# Altium schematic sheet Jukebox Schematic.SchDoc
size C
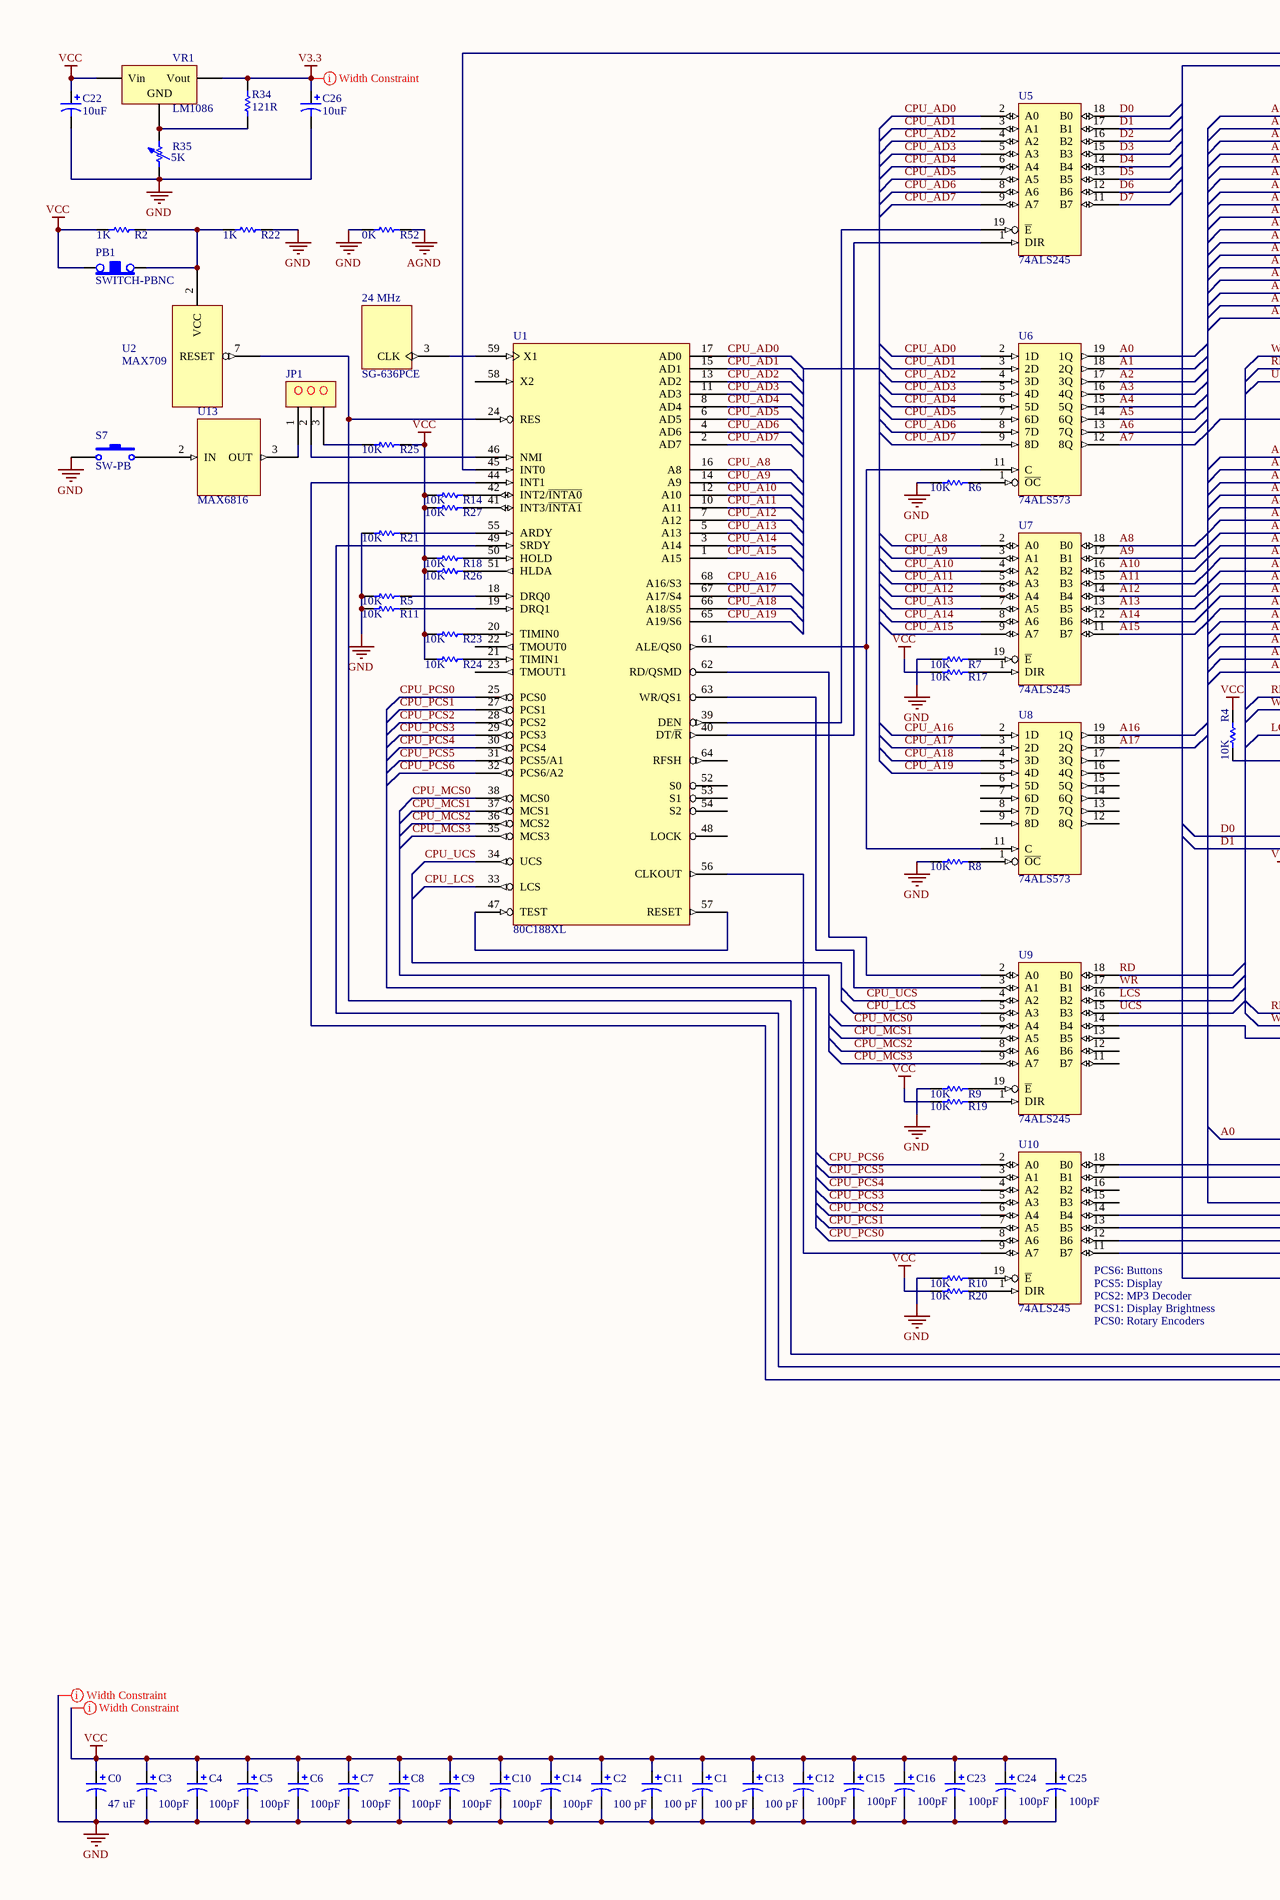
[diagram p0: Jukebox Schematic.SchDoc, left]
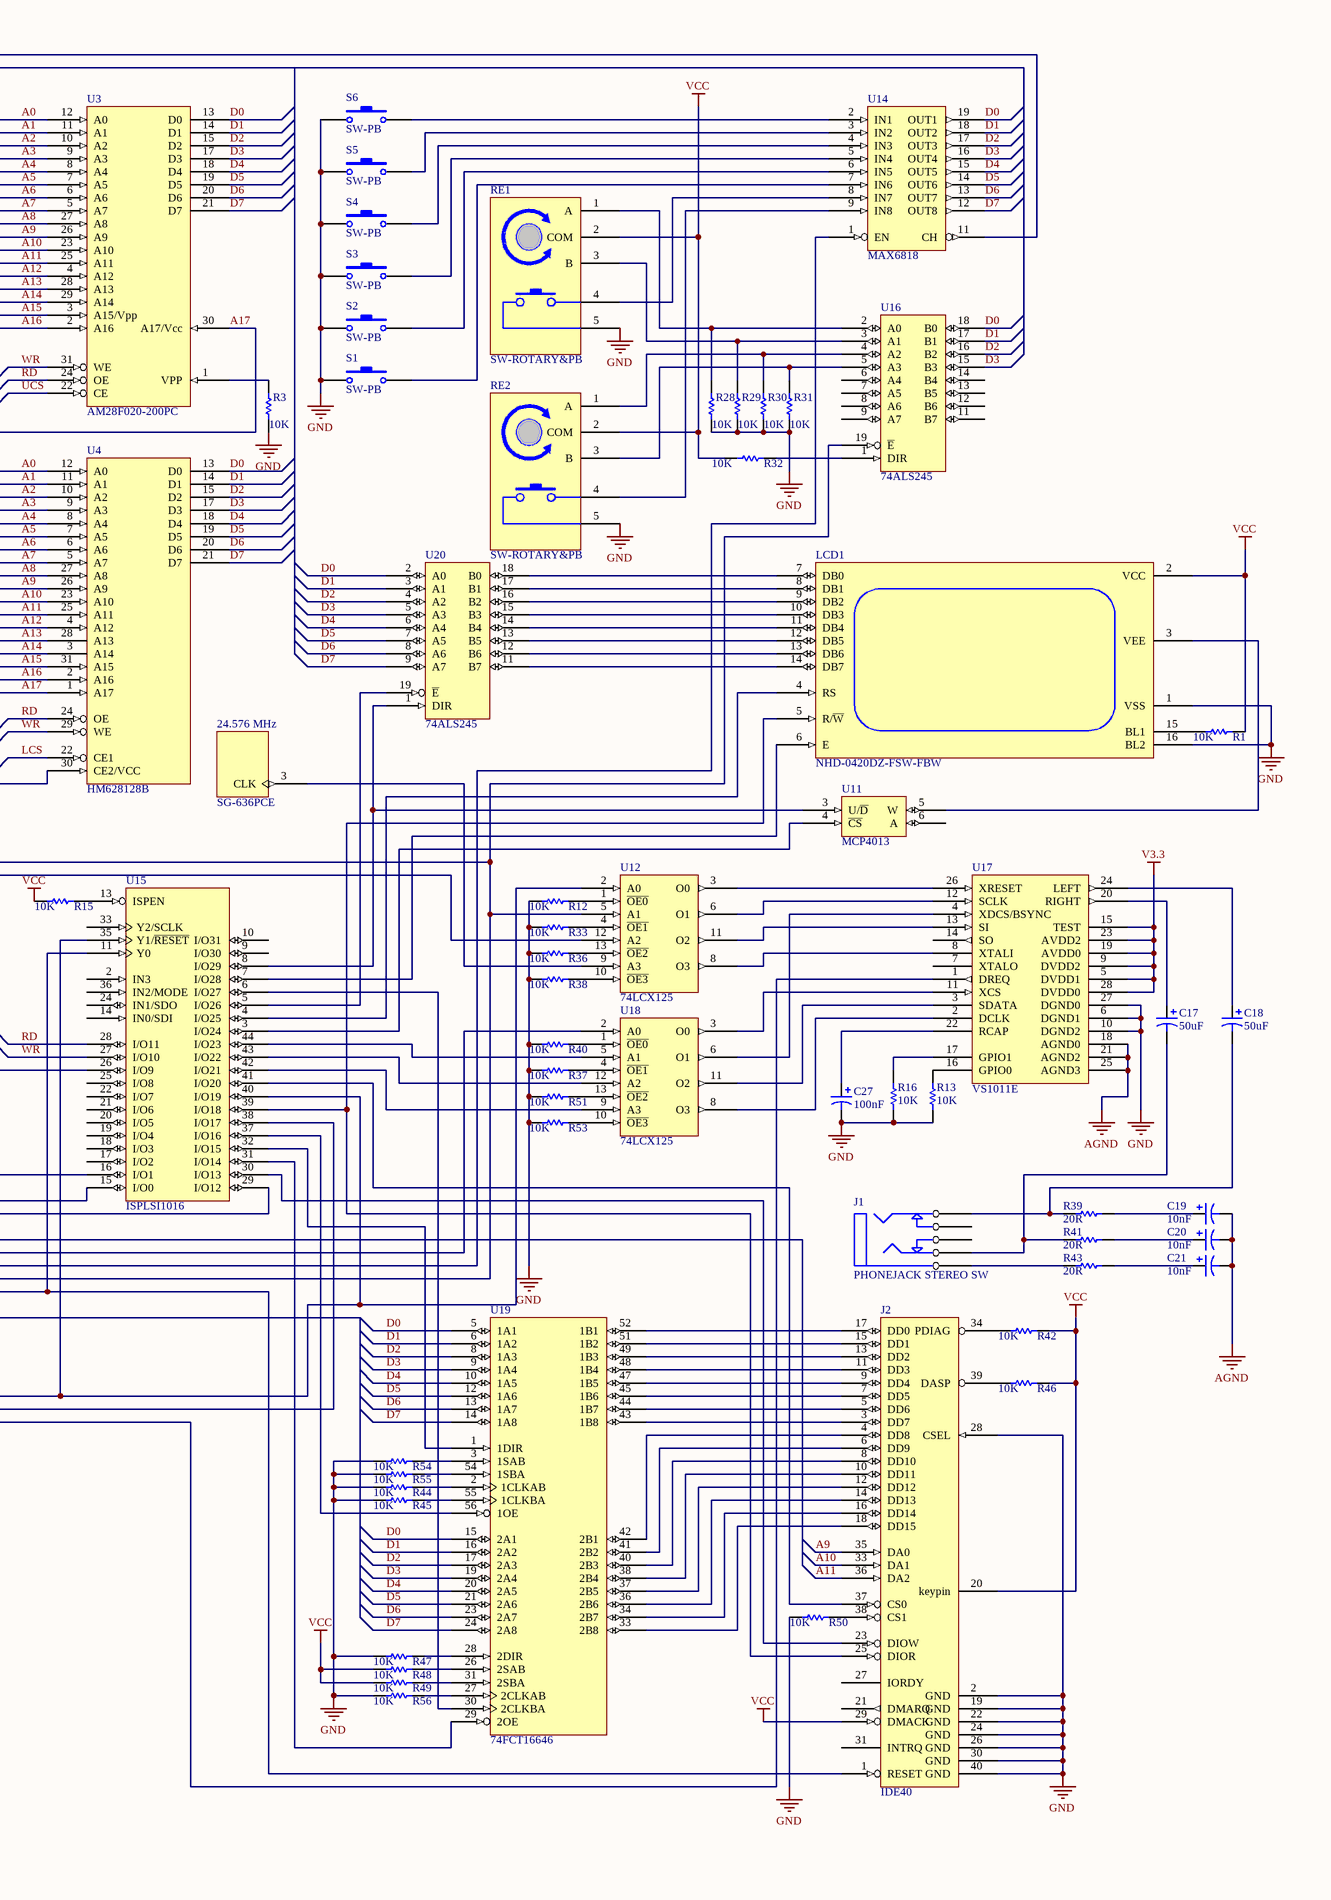
[diagram p1: Jukebox Schematic.SchDoc, right]

## Parts
24.576_MHz  SG-636PCE  [SG636PCE]
24_MHz  SG-636PCE  [SG636PCE]
C0  value 47 uF  [C0805]  (hidden comment: Cap Pol3)
C1  value 100 pF  [C0805]  (hidden comment: Cap Pol3)
C2  value 100 pF  [C0805]  (hidden comment: Cap Pol3)
C3  value 100pF  [C0805]  (hidden comment: Cap Pol3)
C4  value 100pF  [C0805]  (hidden comment: Cap Pol3)
C5  value 100pF  [C0805]  (hidden comment: Cap Pol3)
C6  value 100pF  [C0805]  (hidden comment: Cap Pol3)
C7  value 100pF  [C0805]  (hidden comment: Cap Pol3)
C8  value 100pF  [C0805]  (hidden comment: Cap Pol3)
C9  value 100pF  [C0805]  (hidden comment: Cap Pol3)
C10  value 100pF  [C0805]  (hidden comment: Cap Pol3)
C11  value 100 pF  [C0805]  (hidden comment: Cap Pol3)
C12  value 100pF  [C0805]  (hidden comment: Cap Pol3)
C13  value 100 pF  [C0805]  (hidden comment: Cap Pol3)
C14  value 100pF  [C0805]  (hidden comment: Cap Pol3)
C15  value 100pF  [C0805]  (hidden comment: Cap Pol3)
C16  value 100pF  [C0805]  (hidden comment: Cap Pol3)
C17  value 50uF  [C0805]  (hidden comment: Cap Pol3)
C18  value 50uF  [C0805]  (hidden comment: Cap Pol3)
C19  value 10nF  [C0805]  (hidden comment: Cap Pol3)
C20  value 10nF  [C0805]  (hidden comment: Cap Pol3)
C21  value 10nF  [C0805]  (hidden comment: Cap Pol3)
C22  value 10uF  [C0805]  (hidden comment: Cap Pol3)
C23  value 100pF  [C0805]  (hidden comment: Cap Pol3)
C24  value 100pF  [C0805]  (hidden comment: Cap Pol3)
C25  value 100pF  [C0805]  (hidden comment: Cap Pol3)
C26  value 10uF  [C0805]  (hidden comment: Cap Pol3)
C27  value 100nF  [C0805]  (hidden comment: Cap Pol3)
J1  PHONEJACK STEREO SW  [SJ1-352]
J2  IDE40  [SIP2X20]
JP1  3P_JP  [3P_JP]  (value not drawn)
LCD1  NHD-0420DZ-FSW-FBW  [20x4Disp]
PB1  SWITCH-PBNC  [SIP2]
R1  value 10K  [AXIAL-0.3]  (hidden comment: Res1)
R2  value 1K  [AXIAL-0.3]  (hidden comment: Res1)
R3  value 10K  [AXIAL-0.3]  (hidden comment: Res1)
R4  value 10K  [AXIAL-0.3]  (hidden comment: Res1)
R5  value 10K  [AXIAL-0.3]  (hidden comment: Res1)
R6  value 10K  [AXIAL-0.3]  (hidden comment: Res1)
R7  value 10K  [AXIAL-0.3]  (hidden comment: Res1)
R8  value 10K  [AXIAL-0.3]  (hidden comment: Res1)
R9  value 10K  [AXIAL-0.3]  (hidden comment: Res1)
R10  value 10K  [AXIAL-0.3]  (hidden comment: Res1)
R11  value 10K  [AXIAL-0.3]  (hidden comment: Res1)
R12  value 10K  [AXIAL-0.3]  (hidden comment: Res1)
R13  value 10K  [AXIAL-0.3]  (hidden comment: Res1)
R14  value 10K  [AXIAL-0.3]  (hidden comment: Res1)
R15  value 10K  [AXIAL-0.3]  (hidden comment: Res1)
R16  value 10K  [AXIAL-0.3]  (hidden comment: Res1)
R17  value 10K  [AXIAL-0.3]  (hidden comment: Res1)
R18  value 10K  [AXIAL-0.3]  (hidden comment: Res1)
R19  value 10K  [AXIAL-0.3]  (hidden comment: Res1)
R20  value 10K  [AXIAL-0.3]  (hidden comment: Res1)
R21  value 10K  [AXIAL-0.3]  (hidden comment: Res1)
R22  value 1K  [AXIAL-0.3]  (hidden comment: Res1)
R23  value 10K  [AXIAL-0.3]  (hidden comment: Res1)
R24  value 10K  [AXIAL-0.3]  (hidden comment: Res1)
R25  value 10K  [AXIAL-0.3]  (hidden comment: Res1)
R26  value 10K  [AXIAL-0.3]  (hidden comment: Res1)
R27  value 10K  [AXIAL-0.3]  (hidden comment: Res1)
R28  value 10K  [AXIAL-0.3]  (hidden comment: Res1)
R29  value 10K  [AXIAL-0.3]  (hidden comment: Res1)
R30  value 10K  [AXIAL-0.3]  (hidden comment: Res1)
R31  value 10K  [AXIAL-0.3]  (hidden comment: Res1)
R32  value 10K  [AXIAL-0.3]  (hidden comment: Res1)
R33  value 10K  [AXIAL-0.3]  (hidden comment: Res1)
R34  value 121R  [AXIAL-0.3]  (hidden comment: Res1)
R35  value 5K  [AXIAL-0.7]  (hidden comment: Res Adj1)
R36  value 10K  [AXIAL-0.3]  (hidden comment: Res1)
R37  value 10K  [AXIAL-0.3]  (hidden comment: Res1)
R38  value 10K  [AXIAL-0.3]  (hidden comment: Res1)
R39  value 20R  [AXIAL-0.3]  (hidden comment: Res1)
R40  value 10K  [AXIAL-0.3]  (hidden comment: Res1)
R41  value 20R  [AXIAL-0.3]  (hidden comment: Res1)
R42  value 10K  [AXIAL-0.3]  (hidden comment: Res1)
R43  value 20R  [AXIAL-0.3]  (hidden comment: Res1)
R44  value 10K  [AXIAL-0.3]  (hidden comment: Res1)
R45  value 10K  [AXIAL-0.3]  (hidden comment: Res1)
R46  value 10K  [AXIAL-0.3]  (hidden comment: Res1)
R47  value 10K  [AXIAL-0.3]  (hidden comment: Res1)
R48  value 10K  [AXIAL-0.3]  (hidden comment: Res1)
R49  value 10K  [AXIAL-0.3]  (hidden comment: Res1)
R50  value 10K  [AXIAL-0.3]  (hidden comment: Res1)
R51  value 10K  [AXIAL-0.3]  (hidden comment: Res1)
R52  value 0K  [AXIAL-0.3]  (hidden comment: Res1)
R53  value 10K  [AXIAL-0.3]  (hidden comment: Res1)
R54  value 10K  [AXIAL-0.3]  (hidden comment: Res1)
R55  value 10K  [AXIAL-0.3]  (hidden comment: Res1)
R56  value 10K  [AXIAL-0.3]  (hidden comment: Res1)
RE1  SW-ROTARY&PB  [ROTENCPB]
RE2  SW-ROTARY&PB  [ROTENCPB]
S1  SW-PB  [PB_EG4791]
S2  SW-PB  [PB_EG4791]
S3  SW-PB  [PB_EG4791]
S4  SW-PB  [PB_EG4791]
S5  SW-PB  [PB_EG4791]
S6  SW-PB  [PB_EG4791]
S7  SW-PB  [PB_EG4791]
U1  80C188XL  [PLCCS68I]
U2  MAX709  [UMAX8]
U3  AM28F020-200PC  [DIPS32]
U4  HM628128B  [DIP32]
U5  74ALS245  [SSOP20]
U6  74ALS573  [SSOP20]
U7  74ALS245  [SSOP20]
U8  74ALS573  [SSOP20]
U9  74ALS245  [SSOP20]
U10  74ALS245  [SSOP20]
U11  MCP4013  [SOT-23-6]
U12  74LCX125  [SOIC 14]
U13  MAX6816  [SOT-143]
U14  MAX6818  [SSOP20]
U15  ISPLSI1016  [TQFP44]
U16  74ALS245  [SSOP20]
U17  VS1011E  [SOL-28]
U18  74LCX125  [SOIC 14]
U19  74FCT16646  [TSSOP56]
U20  74ALS245  [SSOP20]
VR1  LM1086  [D2PAK_N]

## Nets
AGND: C19.2 C20.2 C21.2 R52.1 U17.18(AGND0) U17.21(AGND2) U17.25(AGND3)
GND: 24.576_MHz.2(GND) 24_MHz.2(GND) C0.2 C1.2 C2.2 C3.2 C4.2 C5.2 C6.2 C7.2 C8.2 C9.2 C10.2 C11.2 C12.2 C13.2 C14.2 C15.2 C16.2 C22.2 C23.2 C24.2 C25.2 C26.2 C27.2 J2.2(GND) J2.19(GND) J2.22(GND) J2.24(GND) J2.26(GND) J2.28(CSEL) J2.30(GND) J2.40(GND) LCD1.1(VSS) LCD1.16(BL2) R3.1 R5.1 R6.1 R7.1 R8.1 R9.1 R10.1 R11.1 R12.1 R13.1 R16.1 R21.1 R22.1 R28.1 R29.1 R30.1 R31.1 R33.1 R35.1 R36.1 R37.1 R38.1 R40.1 R44.1 R45.1 R47.1 R50.1 R51.1 R52.2 R53.1 R54.1 R55.1 R56.1 RE1.5 RE2.5 S1.1 S2.1 S3.1 S4.1 S5.1 S6.1 S7.1 U1.26(GND) U1.60(GND) U2.3(GND) U3.16(GND) U4.16(GND) U5.10(GND) U6.10(GND) U7.10(GND) U8.10(GND) U9.10(GND) U10.10(GND) U11.2(GND) U12.7(GND) U13.1(GND) U14.10(GND) U15.1(GND) U15.23(GND) U16.10(GND) U17.6(DGND1) U17.10(DGND2) U17.27(DGND0) U18.7(GND) U19.4(GND) U19.11(GND) U19.18(GND) U19.25(GND) U19.32(GND) U19.39(GND) U19.46(GND) U19.53(GND) U20.10(GND)
V3.3: C26.1 R34.2 U12.14(VCC) U17.5(DVDD1) U17.9(DVDD2) U17.15(TEST) U17.19(AVDD0) U17.23(AVDD2) U17.28(DVDD0) U18.14(VCC) VR1.3(Vout)
VCC: 24.576_MHz.4(VCC) 24_MHz.4(VCC) C0.1 C1.1 C2.1 C3.1 C4.1 C5.1 C6.1 C7.1 C8.1 C9.1 C10.1 C11.1 C12.1 C13.1 C14.1 C15.1 C16.1 C22.1 C23.1 C24.1 C25.1 J2.20(keypin) J2.29(DMACK) LCD1.2(VCC) PB1.1 R1.2 R2.1 R4.2 R14.1 R15.1 R17.1 R18.1 R19.1 R20.1 R23.1 R24.1 R25.1 R26.1 R27.1 R32.2 R42.2 R46.2 R48.1 R49.1 RE1.2(COM) RE2.2(COM) U1.9(VCC) U1.43(VCC) U3.32(VCC) U4.32(VCC) U5.20(VCC) U6.20(VCC) U7.20(VCC) U8.20(VCC) U9.20(VCC) U10.20(VCC) U11.1(VCC) U13.4(VCC) U14.20(VCC) U15.12(VCC) U15.34(VCC) U16.20(VCC) U19.7(VCC) U19.22(VCC) U19.35(VCC) U19.50(VCC) U20.20(VCC) VR1.1(Vin)
A0: U3.12(A0) U4.12(A0) U6.19(1Q) U15.16(I/O1)
A1: U3.11(A1) U4.11(A1) U6.18(2Q)
A2: U3.10(A2) U4.10(A2) U6.17(3Q)
A3: U3.9(A3) U4.9(A3) U6.16(4Q)
A4: U3.8(A4) U4.8(A4) U6.15(5Q)
A5: U3.7(A5) U4.7(A5) U6.14(6Q)
A6: U3.6(A6) U4.6(A6) U6.13(7Q)
A7: U3.5(A7) U4.5(A7) U6.12(8Q)
A8: U3.27(A8) U4.27(A8) U7.18(B0)
A9: J2.35(DA0) U3.26(A9) U4.26(A9) U7.17(B1)
A10: J2.33(DA1) U3.23(A10) U4.23(A10) U7.16(B2)
A11: J2.36(DA2) U3.25(A11) U4.25(A11) U7.15(B3)
A12: U3.4(A12) U4.4(A12) U7.14(B4)
A13: U3.28(A13) U4.28(A13) U7.13(B5)
A14: U3.29(A14) U4.3(A14) U7.12(B6)
A15: U3.3(A15/Vpp) U4.31(A15) U7.11(B7)
A16: U3.2(A16) U4.2(A16) U8.19(1Q)
A17: U3.30(A17/Vcc) U4.1(A17) U8.18(2Q)
CPU_A8: U1.16(A8) U7.2(A0)
CPU_A9: U1.14(A9) U7.3(A1)
CPU_A10: U1.12(A10) U7.4(A2)
CPU_A11: U1.10(A11) U7.5(A3)
CPU_A12: U1.7(A12) U7.6(A4)
CPU_A13: U1.5(A13) U7.7(A5)
CPU_A14: U1.3(A14) U7.8(A6)
CPU_A15: U1.1(A15) U7.9(A7)
CPU_A16: U1.68(A16/S3) U8.2(1D)
CPU_A17: U1.67(A17/S4) U8.3(2D)
CPU_A18: U1.66(A18/S5) U8.4(3D)
CPU_A19: U1.65(A19/S6) U8.5(4D)
CPU_AD0: U1.17(AD0) U5.2(A0) U6.2(1D)
CPU_AD1: U1.15(AD1) U5.3(A1) U6.3(2D)
CPU_AD2: U1.13(AD2) U5.4(A2) U6.4(3D)
CPU_AD3: U1.11(AD3) U5.5(A3) U6.5(4D)
CPU_AD4: U1.8(AD4) U5.6(A4) U6.6(5D)
CPU_AD5: U1.6(AD5) U5.7(A5) U6.7(6D)
CPU_AD6: U1.4(AD6) U5.8(A6) U6.8(7D)
CPU_AD7: U1.2(AD7) U5.9(A7) U6.9(8D)
CPU_LCS: U1.33(LCS) U9.5(A3)
CPU_MCS0: U1.38(MCS0) U9.6(A4)
CPU_MCS1: U1.37(MCS1) U9.7(A5)
CPU_MCS2: U1.36(MCS2) U9.8(A6)
CPU_MCS3: U1.35(MCS3) U9.9(A7)
CPU_PCS0: U1.25(PCS0) U10.8(A6)
CPU_PCS1: U1.27(PCS1) U10.7(A5)
CPU_PCS2: U1.28(PCS2) U10.6(A4)
CPU_PCS3: U1.29(PCS3) U10.5(A3)
CPU_PCS4: U1.30(PCS4) U10.4(A2)
CPU_PCS5: U1.31(PCS5/A1) U10.3(A1)
CPU_PCS6: U1.32(PCS6/A2) U10.2(A0)
CPU_UCS: U1.34(UCS) U9.4(A2)
D0: U3.13(D0) U4.13(D0) U5.18(B0) U10.12(B6) U12.5(A1) U14.19(OUT1) U16.18(B0) U16.19(~{E}) U19.5(1A1) U19.15(2A1) U20.2(A0)
D1: U3.14(D1) U4.14(D1) U5.17(B1) U12.12(A2) U14.18(OUT2) U16.17(B1) U19.6(1A2) U19.16(2A2) U20.3(A1)
D2: U3.15(D2) U4.15(D2) U5.16(B2) U14.17(OUT3) U16.16(B2) U19.8(1A3) U19.17(2A3) U20.4(A2)
D3: U3.17(D3) U4.17(D3) U5.15(B3) U14.16(OUT4) U16.15(B3) U19.9(1A4) U19.19(2A4) U20.5(A3)
D4: U3.18(D4) U4.18(D4) U5.14(B4) U14.15(OUT5) U19.10(1A5) U19.20(2A5) U20.6(A4)
D5: U3.19(D5) U4.19(D5) U5.13(B5) U14.14(OUT6) U19.12(1A6) U19.21(2A6) U20.7(A5)
D6: U3.20(D6) U4.20(D6) U5.12(B6) U14.13(OUT7) U19.13(1A7) U19.23(2A7) U20.8(A6)
D7: U3.21(D7) U4.21(D7) U5.11(B7) U14.12(OUT8) U19.14(1A8) U19.24(2A8) U20.9(A7)
LCS: U4.22(CE1) U9.16(B2)
RD: U3.24(OE) U4.24(OE) U9.18(B0) U15.28(I/O11)
UCS: U3.22(CE) U9.15(B3)
WR: U3.31(WE) U4.29(WE) U9.17(B1) U15.27(I/O10)
Net24.576_MHz_3: 24.576_MHz.3(CLK) U12.9(A3)
Net24_MHz_3: 24_MHz.3(CLK) U1.59(X1)
NetC17_1: C17.1 U17.20(RIGHT)
NetC17_2: C17.2 J1.D(TIP) R41.2
NetC18_1: C18.1 U17.24(LEFT)
NetC18_2: C18.2 J1.A(RING) R39.2
NetC19_1: C19.1 R39.1
NetC20_1: C20.1 R41.1
NetC21_1: C21.1 R43.1
NetC27_1: C27.1 U17.22(RCAP)
NetJ1_E: J1.E(SLEEVE) R43.2
NetJ2_1: J2.1(RESET) U10.11(B7) U15.11(Y0)
NetJ2_3: J2.3(DD7) U19.43(1B8)
NetJ2_4: J2.4(DD8) U19.42(2B1)
NetJ2_5: J2.5(DD6) U19.44(1B7)
NetJ2_6: J2.6(DD9) U19.41(2B2)
NetJ2_7: J2.7(DD5) U19.45(1B6)
NetJ2_8: J2.8(DD10) U19.40(2B3)
NetJ2_9: J2.9(DD4) U19.47(1B5)
NetJ2_10: J2.10(DD11) U19.38(2B4)
NetJ2_11: J2.11(DD3) U19.48(1B4)
NetJ2_12: J2.12(DD12) U19.37(2B5)
NetJ2_13: J2.13(DD2) U19.49(1B3)
NetJ2_14: J2.14(DD13) U19.36(2B6)
NetJ2_15: J2.15(DD1) U19.51(1B2)
NetJ2_16: J2.16(DD14) U19.34(2B7)
NetJ2_17: J2.17(DD0) U19.52(1B1)
NetJ2_18: J2.18(DD15) U19.33(2B8)
NetJ2_23: J2.23(DIOW) U15.30(I/O13)
NetJ2_25: J2.25(DIOR) LCD1.5(R/~{W}) U15.39(I/O18)
NetJ2_34: J2.34(PDIAG) R42.1
NetJ2_37: J2.37(CS0) U15.41(I/O20)
NetJ2_38: J2.38(CS1) R50.2
NetJ2_39: J2.39(DASP) R46.1
NetJP1_1: JP1.1 U13.3(OUT)
NetJP1_2: JP1.2 U1.46(NMI)
NetJP1_3: JP1.3 R25.2
NetLCD1_3: LCD1.3(VEE) U11.5(W)
NetLCD1_4: LCD1.4(RS) U15.4(I/O25)
NetLCD1_6: LCD1.6(E) U15.7(I/O28)
NetLCD1_7: LCD1.7(DB0) U20.18(B0)
NetLCD1_8: LCD1.8(DB1) U20.17(B1)
NetLCD1_9: LCD1.9(DB2) U20.16(B2)
NetLCD1_10: LCD1.10(DB3) U20.15(B3)
NetLCD1_11: LCD1.11(DB4) U20.14(B4)
NetLCD1_12: LCD1.12(DB5) U20.13(B5)
NetLCD1_13: LCD1.13(DB6) U20.12(B6)
NetLCD1_14: LCD1.14(DB7) U20.11(B7)
NetLCD1_15: LCD1.15(BL1) R1.1
NetPB1_2: PB1.2 R2.2 R22.2 U2.2(VCC)
NetR3_2: R3.2 U3.1(VPP)
NetR4_1: R4.1 U4.30(CE2/VCC)
NetR5_2: R5.2 U1.18(DRQ0)
NetR6_2: R6.2 U6.1(~{OC})
NetR7_2: R7.2 U7.19(~{E})
NetR8_2: R8.2 U8.1(~{OC})
NetR9_2: R9.2 U9.19(~{E})
NetR10_2: R10.2 U10.19(~{E})
NetR11_2: R11.2 U1.19(DRQ1)
NetR12_2: R12.2 U12.1(~{O}~{E}~{0})
NetR13_2: R13.2 U17.16(GPIO0)
NetR14_2: R14.2 U1.42(INT2/~{INTA0})
NetR15_2: R15.2 U15.13(ISPEN)
NetR16_2: R16.2 U17.17(GPIO1)
NetR17_2: R17.2 U7.1(DIR)
NetR18_2: R18.2 U1.50(HOLD)
NetR19_2: R19.2 U9.1(DIR)
NetR20_2: R20.2 U10.1(DIR)
NetR21_2: R21.2 U1.55(ARDY)
NetR23_2: R23.2 U1.20(TIMIN0)
NetR24_2: R24.2 U1.21(TIMIN1)
NetR26_2: R26.2 U1.51(HLDA)
NetR27_2: R27.2 U1.41(INT3/~{INTA1})
NetR28_2: R28.2 RE1.1(A) U16.2(A0)
NetR29_2: R29.2 RE1.3(B) U16.3(A1)
NetR30_2: R30.2 RE2.1(A) U16.4(A2)
NetR31_2: R31.2 RE2.3(B) U16.5(A3)
NetR32_1: R32.1 U16.1(DIR)
NetR33_2: R33.2 U12.4(~{O}~{E}~{1})
NetR34_1: R34.1 R35.2 VR1.2(GND)
NetR36_2: R36.2 U12.13(~{OE2})
NetR37_2: R37.2 U18.4(~{O}~{E}~{1})
NetR38_2: R38.2 U12.10(~{OE3})
NetR40_2: R40.2 U18.1(~{O}~{E}~{0})
NetR44_2: R44.2 U19.2(1CLKAB)
NetR45_2: R45.2 U19.55(1CLKBA)
NetR47_2: R47.2 U19.28(2DIR)
NetR48_2: R48.2 U19.26(2SAB)
NetR49_2: R49.2 U19.31(2SBA)
NetR51_2: R51.2 U18.13(~{OE2})
NetR53_2: R53.2 U18.10(~{OE3})
NetR54_2: R54.2 U19.3(1SAB)
NetR55_2: R55.2 U19.54(1SBA)
NetR56_2: R56.2 U19.27(2CLKAB)
NetRE1_4: RE1.4 U14.8(IN7)
NetRE2_4: RE2.4 U14.9(IN8)
NetS1_2: S1.2 U14.7(IN6)
NetS2_2: S2.2 U14.6(IN5)
NetS3_2: S3.2 U14.5(IN4)
NetS4_2: S4.2 U14.4(IN3)
NetS5_2: S5.2 U14.3(IN2)
NetS6_2: S6.2 U14.2(IN1)
NetS7_2: S7.2 U13.2(IN)
NetU1_24: U1.24(RES) U2.7(RESET) U12.2(A0) U15.35(Y1/~{RESET}) U15.40(I/O19)
NetU1_39: U1.39(DEN) U5.19(~{E})
NetU1_40: U1.40(DT/~{R}) U5.1(DIR)
NetU1_44: U1.44(INT1) U17.1(DREQ)
NetU1_45: U1.45(INT0) U14.11(CH)
NetU1_47: U1.47(TEST) U1.57(RESET)
NetU1_49: U1.49(SRDY) U15.38(I/O17)
NetU1_56: U1.56(CLKOUT) U10.9(A7)
NetU1_61: U1.61(ALE/QS0) U6.11(C) U8.11(C)
NetU1_62: U1.62(RD/QSMD) U9.2(A0)
NetU1_63: U1.63(WR/QS1) U9.3(A1)
NetU9_14: U9.14(B4) U15.26(I/O9)
NetU10_13: U10.13(B5) U14.1(EN)
NetU10_14: U10.14(B4) U18.2(A0)
NetU10_17: U10.17(B1) U15.29(I/O12)
NetU10_18: U10.18(B0) U15.15(I/O0)
NetU11_3: U11.3(U/~{D}) U15.8(I/O29) U20.1(DIR)
NetU11_4: U11.4(~{CS}) U15.3(I/O24)
NetU12_3: U12.3(O0) U17.26(XRESET)
NetU12_6: U12.6(O1) U17.12(SCLK)
NetU12_8: U12.8(O3) U17.8(XTALI)
NetU12_11: U12.11(O2) U17.13(SI)
NetU15_5: U15.5(I/O26) U20.19(~{E})
NetU15_6: U15.6(I/O27) U19.30(2CLKBA)
NetU15_31: U15.31(I/O14) U19.29(2OE)
NetU15_32: U15.32(I/O15) U19.1(1DIR)
NetU15_37: U15.37(I/O16) U19.56(1OE)
NetU15_42: U15.42(I/O21) U18.9(A3)
NetU15_43: U15.43(I/O22) U18.12(A2)
NetU15_44: U15.44(I/O23) U18.5(A1)
NetU17_2: U17.2(DCLK) U18.8(O3)
NetU17_3: U17.3(SDATA) U18.11(O2)
NetU17_4: U17.4(XDCS/BSYNC) U18.6(O1)
NetU17_11: U17.11(XCS) U18.3(O0)

Not connected (* = marked no-connect by the designer): J1 B(RINGSW) C(TIPSW); J2 21(DMARQ) 27(IORDY) 31(INTRQ); U1 22(TMOUT0) 23(TMOUT1) 48(LOCK) 52(S0) 53(S1) 54(S2) 58(X2) 64(RFSH); U8 6(5D) 7(6D) 8(7D) 9(8D) 12(8Q) 13(7Q) 14(6Q) 15(5Q) 16(4Q) 17(3Q); U9 11(B7) 12(B6) 13(B5); U10 15(B3) 16(B2); U11 6(A); U15 2(IN3) 9(I/O30) 10(I/O31) 14(IN0/SDI) 17(I/O2) 18(I/O3) 19(I/O4) 20(I/O5) 21(I/O6) 22(I/O7) 24(IN1/SDO) 25(I/O8) 33(Y2/SCLK) 36(IN2/MODE); U16 6(A4) 7(A5) 8(A6) 9(A7) 11(B7) 12(B6) 13(B5) 14(B4); U17 7(XTALO) 14(SO)

## Layout directives
rule Width Constraint [Pref Width = 30mil    Min Width = 8mil    Max Width = 30mil]: GND, V3.3, VCC

## Notes on the sheet
- (near U10) PCS6: Buttons
- (near U10) PCS5: Display
- (near U10) PCS1: Display Brightness
- (near U10) PCS0: Rotary Encoders
- (near U10) PCS2: MP3 Decoder

## Library data of the parts
24.576_MHz 24_MHz = OSC: TTL/CMOS Oscillator
C0-C27 = Cap Pol3: Polarized Capacitor (Surface Mount); Published: 8-Jun-2000; LatestRevisionDate: 29-May-2009; LatestRevisionNote: IPC-7351 Footprint Added.; PackageReference: C0805; Publisher: Altium Limited; PackageDescription: Chip Capacitor
J1 = PHONEJACK STEREO SW: 3.5mm Stereo Jack with Switches
J2 = IDE40: 40-Pin IDE Connector
LCD1 = LCDBL16PIN: Single E LCD with Backlight
PB1 = SWITCH-PBNC: Normally Closed Pushbutton Switch
R1-R34 R36-R56 = Res1: Resistor; Published: 8-Jun-2000; LatestRevisionDate: 17-Jul-2002; LatestRevisionNote: Re-released for DXP Platform.; PackageReference: AXIAL-0.3; Publisher: Altium Limited; PackageDescription: Axial Device, Thru-Hole; 2 Leads; 0.3 in Pin Spacing
R35 = Res Adj1: Variable Resistor; Set Position: 0.5; Published: 8-Jun-2000; LatestRevisionDate: 17-Jul-2002; LatestRevisionNote: Re-released for DXP Platform.; PackageReference: AXIAL-0.7; Publisher: Altium Limited; PackageDescription: Axial Device, Thru-Hole; 2 Leads; 0.7 in Pin Spacing
RE1 RE2 = SW-ROTARY&PB: Rotary Encoder with Built-In Push Button
S1-S7 = SW-PB: Switch; Published: 24-Mar-1999; LatestRevisionDate: 17-Jul-2002; LatestRevisionNote: Re-released for DXP Platform.; PackageReference: SPST-2; Publisher: Altium Limited; PackageDescription: Switch; 2 Leads
U1 = 80C188XL: Intel 80188 Microprocessor
U2 = MAX709: Maxim Power-On Reset
U3 = UNIROM: Universal EPROM/EEROM Socket
U4 = UNIRAM: Universal RAM Socket
U5 U7 U9 U10 U16 U20 = 74ALS245: Octal Bus Transceiver
U6 U8 = 74ALS573: Octal Transparent Latch
U13 = MAX6816: Single Switch Debouncer
U14 = MAX6818: Octal Switch Debouncer
U15 = ISPLSI1016: In-System Programmable High Density CPLD
U19 = 74FCT16646: 16-Bit Bus Transceiver/Register
VR1 = Volt Reg: Voltage Regulator; Published: 24-Mar-1999; LatestRevisionDate: 29-May-2009; LatestRevisionNote: IPC-7351 Footprint Added.; PackageReference: D2PAK; Publisher: Altium Limited; PackageDescription: 3-Pin Transistor Outline Package 2.54 mm Pitch, 15.1 mm Lead Span